# Altium schematic sheet 07_Connector.SchDoc
size A4; SheetNumber: 7; SheetTotal: 7
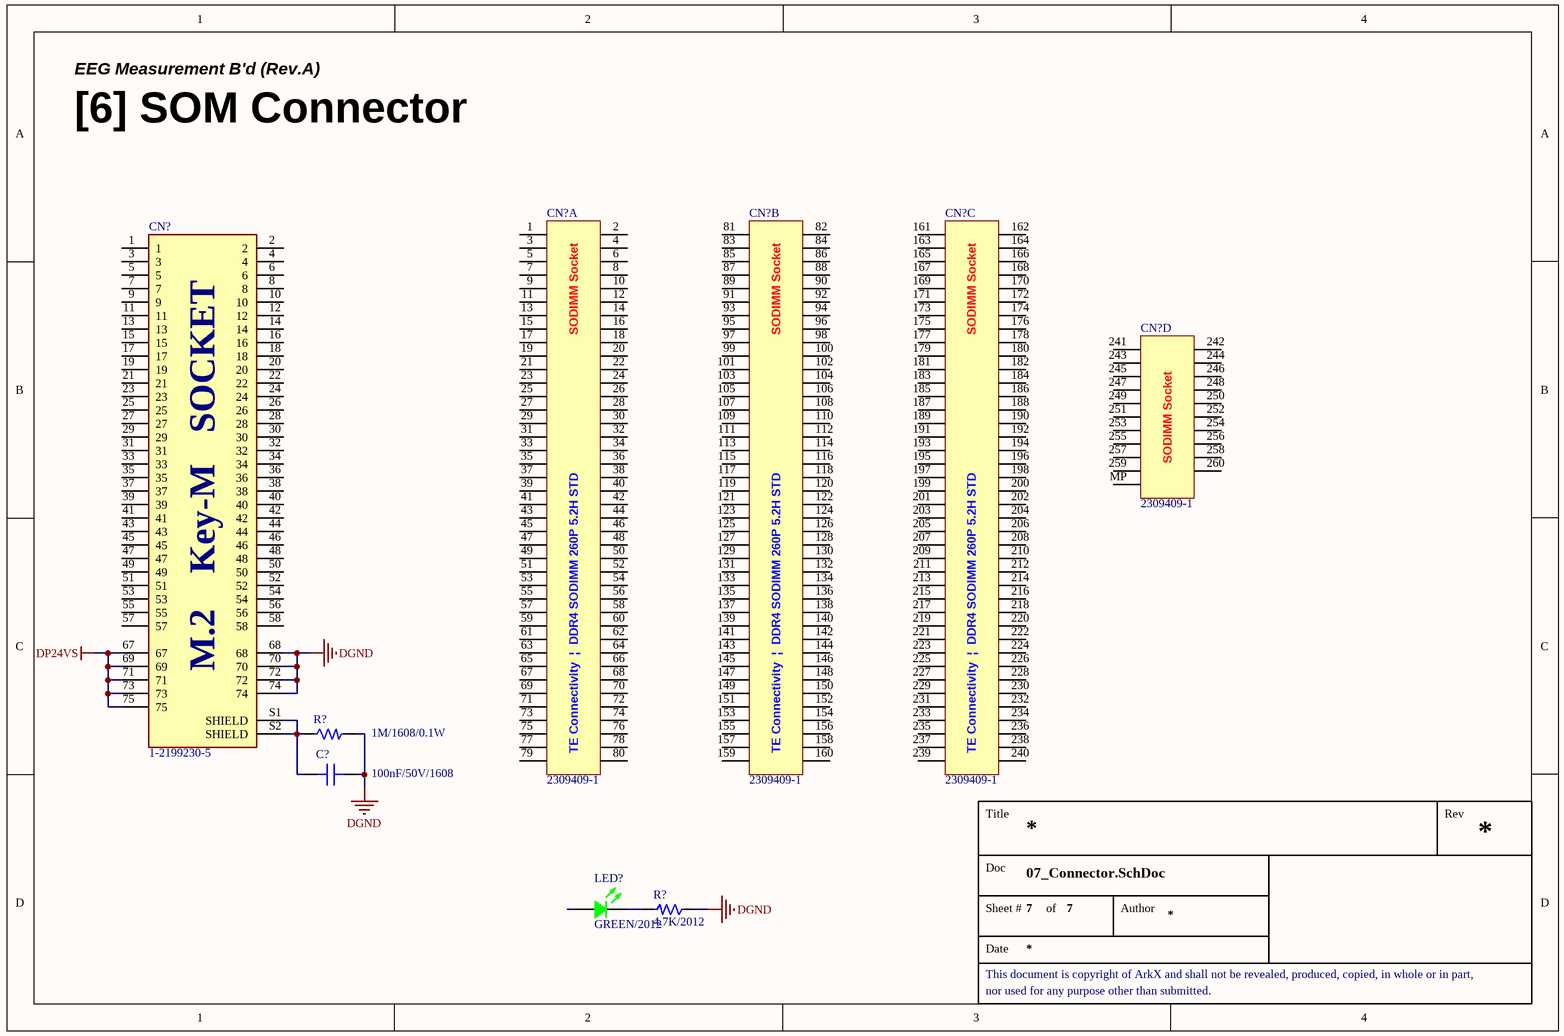
[diagram p0: 07_Connector.SchDoc]

## Parts
(Parts that share a designator on the sheet are numbered #1, #2 ... from top to bottom, then left to right.)
C?  100nF/50V/1608  [CAP 1608 (0603_INCH)]
CN?#1  2309409-1  [CON_SODIMM_2309409-1]  (part D of 4)
CN?#2  1-2199230-5  [CON_M.2-KEY-M_FEMALE_1-2199230-5]  (no BOM)
CN?#3  2309409-1  [CON_SODIMM_2309409-1]  (part B of 4)
CN?#4  2309409-1  [CON_SODIMM_2309409-1]  (part C of 4)
CN?#5  2309409-1  [CON_SODIMM_2309409-1]  (part A of 4)
LED?  GREEN/2012  [LED MHT170RGBCT (GREEN)]
R?#1  1M/1608/0.1W  [RES 1608 (0603_inch)]
R?#2  4.7K/2012  [RES 2012 (0805_inch)]

## Nets
DGND: C?.2 CN?#2.68 CN?#2.70 CN?#2.72 CN?#2.74 R?#1.2 R?#2.1
DP24VS: CN?#2.67 CN?#2.69 CN?#2.71 CN?#2.73 CN?#2.75
NetC?_1: C?.1 CN?#2.S1(SHIELD) CN?#2.S2(SHIELD) R?#1.1
NetLED?_2: LED?.2(GREEN) R?#2.2

Not connected (* = marked no-connect by the designer): CN?#1 241 242 243 244 245 246 247 248 249 250 251 252 253 254 255 256 257 258 259 260 MP; CN?#2 1 2 3 4 5 6 7 8 9 10 11 12 13 14 15 16 17 18 19 20 21 22 23 24 25 26 27 28 29 30 31 32 33 34 35 36 37 38 39 40 41 42 43 44 45 46 47 48 49 50 51 52 53 54 55 56 57 58; CN?#3 81 82 83 84 85 86 87 88 89 90 91 92 93 94 95 96 97 98 99 100 101 102 103 104 105 106 107 108 109 110 111 112 113 114 115 116 117 118 119 120 121 122 123 124 125 126 127 128 129 130 131 132 133 134 135 136 137 138 139 140 141 142 143 144 145 146 147 148 149 150 151 152 153 154 155 156 157 158 159 160; CN?#4 161 162 163 164 165 166 167 168 169 170 171 172 173 174 175 176 177 178 179 180 181 182 183 184 185 186 187 188 189 190 191 192 193 194 195 196 197 198 199 200 201 202 203 204 205 206 207 208 209 210 211 212 213 214 215 216 217 218 219 220 221 222 223 224 225 226 227 228 229 230 231 232 233 234 235 236 237 238 239 240; CN?#5 1 2 3 4 5 6 7 8 9 10 11 12 13 14 15 16 17 18 19 20 21 22 23 24 25 26 27 28 29 30 31 32 33 34 35 36 37 38 39 40 41 42 43 44 45 46 47 48 49 50 51 52 53 54 55 56 57 58 59 60 61 62 63 64 65 66 67 68 69 70 71 72 73 74 75 76 77 78 79 80; LED? 4(Common_Anode)

## Notes on the sheet
- EEG Measurement B'd (Rev.A)
- [6] SOM Connector
- Title
- Rev
- Doc
- Sheet #
- of
- Author
- This document is copyright of ArkX and shall not be revealed, produced, copied, in whole or in part,
- Date
- nor used for any purpose other than submitted.
- (in symbol CON_M.2-KEY-M_FEMALE_1-2199230-5) SOCKET; Key-M; M.2
- (in symbol CON_SODIMM_2309409-1, part A) SODIMM Socket; TE Connectivity  |  DDR4 SODIMM 260P 5.2H STD
- (in symbol CON_SODIMM_2309409-1, part B) SODIMM Socket; TE Connectivity  |  DDR4 SODIMM 260P 5.2H STD
- (in symbol CON_SODIMM_2309409-1, part C) SODIMM Socket; TE Connectivity  |  DDR4 SODIMM 260P 5.2H STD
- (in symbol CON_SODIMM_2309409-1, part D) SODIMM Socket

## Library data of the parts
C? = CAP_100nF/50V/1608: Ceramic CAP_100nF/50V/1608; LCSC Part #: C14663; JLCPCB Part Type: Basic Part
CN?#1 CN?#3-CN?#5 = CON_SODIMM_2309409-1: SO DIMM Socket, Small Outline (SO), Stack Height .205 in [5.2 mm], Right Angle Module Orientation, 260 Position, DDR4 DIMM; Manufacturer: TE Connectivity; Manufacturer Part Number: 2309409-1; JLCPCB Part Type: Extended Part; LCSC Part #: C5164025
CN?#2 = CON_M.2-KEY-M_FEMALE_1-2199230-5: M.2 NGFF Key M Card Edge Connector 0.5mm Pitch 67 Position 4.2mm Height; Manufacturer: TE Connectivity; Manufacturer Part Number: 1-2199230-5; Distributor Link: https://eu.mouser.com/ProductDetail/TE-Connectivity/1-2199230-5?qs=N0TJGnUfxCD5L9UvFjPEwQ%3D%3D; LCSC Part #: C590854; JLCPCB Part Type: Extended Part
LED? = LED_MHT170RGBCT(GREEN): Colorless transparence -30℃~+85℃ Positive post Common anode RGB 120° 0805  Light Emitting Diodes (LED) ROHS; LCSC Part #: C2962094; JLCPCB Part Type: Extended Part
R?#1 = RES_1M/1608/0.1W: Value: 1M; Power Rating: 0.1W; Precision: 1%; Size: 1608; LCSC Part #: C22935; JLCPCB Part Type: Basic Part
R?#2 = RES_4.7K/2012/0.125W: Value: 4.7K; Power Rating: 0.125W; Precision: 1%; Size: 2012; LCSC Part #: C17673; JLCPCB Part Type: Basic Part